# Altium schematic sheet 12-JKFlipFlop.SchDoc
size A4; DocumentNumber: 12; SheetNumber: 12; SheetTotal: 26
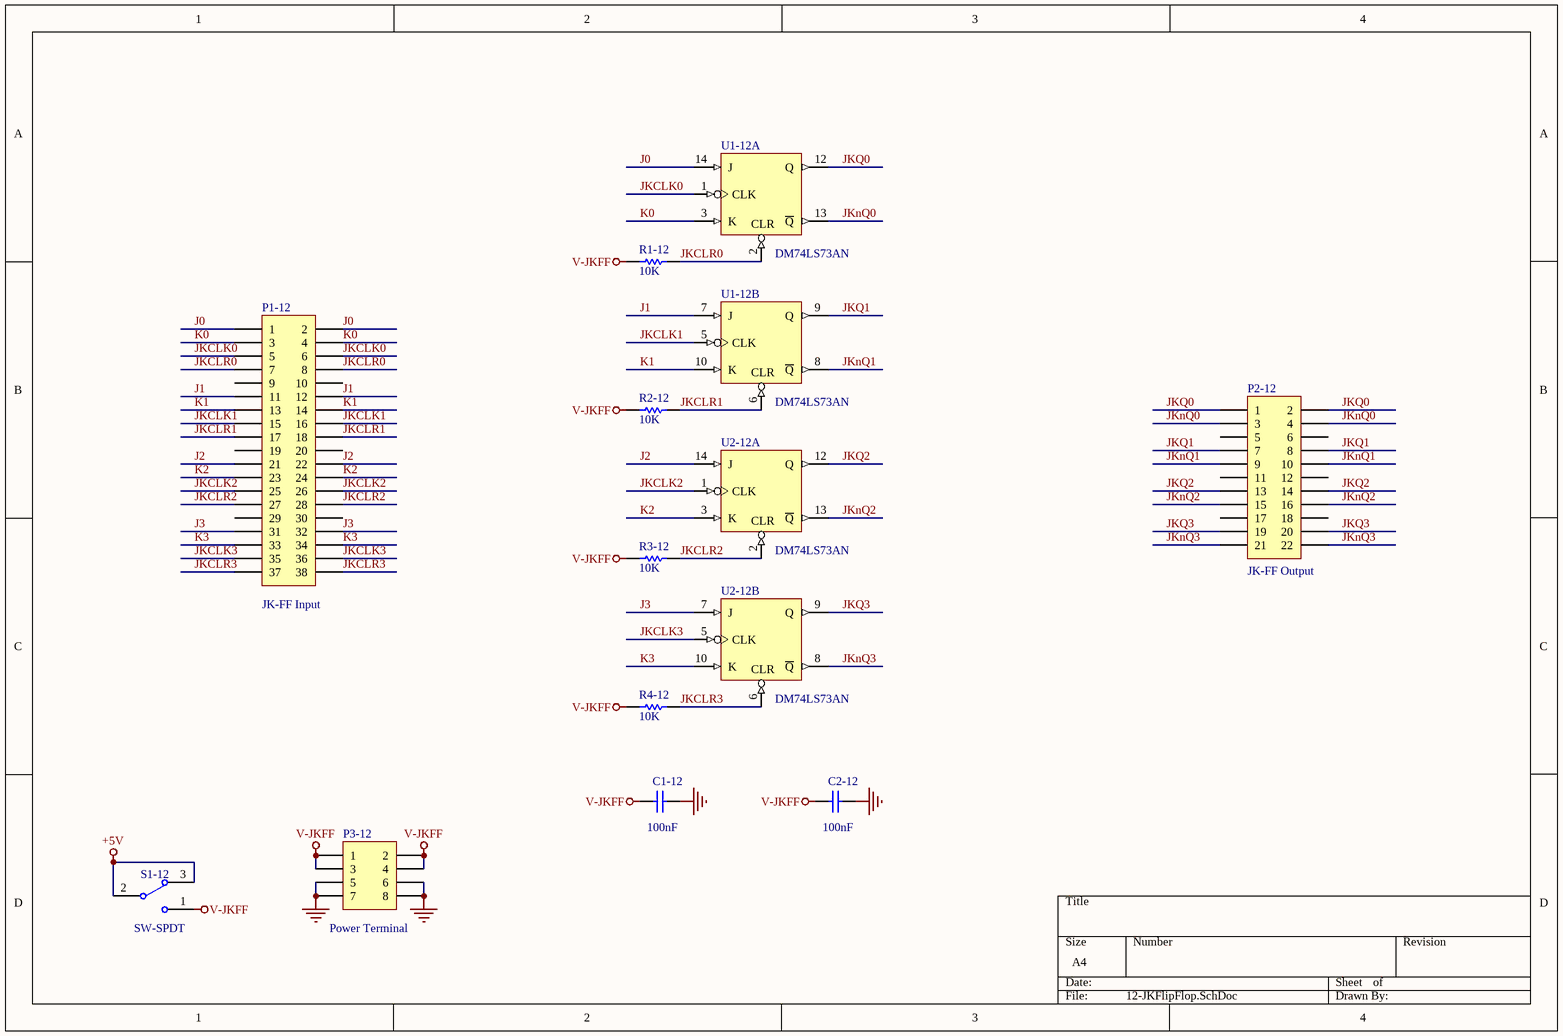
[diagram p0: 12-JKFlipFlop.SchDoc]

## Parts
C1-12  value 100nF  [c-0805]  (hidden comment: 104)
C2-12  value 100nF  [c-0805]  (hidden comment: 104)
P1-12  value JK-FF Input  [JP2.54-F-2x19A]  (hidden comment: Header 19X2)
P2-12  value JK-FF Output  [JP2.54-F-2x11A]  (hidden comment: Header 11X2)
P3-12  Publisher: Power Terminal  [JP2.54-F-2x04A]  (hidden comment: Header 4X2)
R1-12  10K  [R-0805]
R2-12  10K  [R-0805]
R3-12  10K  [R-0805]
R4-12  10K  [R-0805]
S1-12  SW-SPDT  [SW-SLIDE-2P-2W]
U1-12  DM74LS73AN  [SK-DIP14-300]  (parts A,B of 2)
U2-12  DM74LS73AN  [SK-DIP14-300]  (parts A,B of 2)

## Nets
+5V: S1-12.2 S1-12.3
GND: C1-12.2 C2-12.2 P3-12.5 P3-12.6 P3-12.7 P3-12.8 U1-12.11(GND) U2-12.11(GND)
V-JKFF: C1-12.1 C2-12.1 P3-12.1 P3-12.2 P3-12.3 P3-12.4 R1-12.2 R2-12.2 R3-12.2 R4-12.2 S1-12.1
VCC: U1-12.4(V-JKFF) U2-12.4(V-JKFF)
J0: P1-12.1 P1-12.2 U1-12.14(J)
J1: P1-12.11 P1-12.12 U1-12.7(J)
J2: P1-12.21 P1-12.22 U2-12.14(J)
J3: P1-12.31 P1-12.32 U2-12.7(J)
JKCLK0: P1-12.5 P1-12.6 U1-12.1(CLK)
JKCLK1: P1-12.15 P1-12.16 U1-12.5(CLK)
JKCLK2: P1-12.25 P1-12.26 U2-12.1(CLK)
JKCLK3: P1-12.35 P1-12.36 U2-12.5(CLK)
JKCLR0: P1-12.7 P1-12.8 R1-12.1 U1-12.2(CLR)
JKCLR1: P1-12.17 P1-12.18 R2-12.1 U1-12.6(CLR)
JKCLR2: P1-12.27 P1-12.28 R3-12.1 U2-12.2(CLR)
JKCLR3: P1-12.37 P1-12.38 R4-12.1 U2-12.6(CLR)
JKnQ0: P2-12.3 P2-12.4 U1-12.13(~{Q})
JKnQ1: P2-12.9 P2-12.10 U1-12.8(~{Q})
JKnQ2: P2-12.15 P2-12.16 U2-12.13(~{Q})
JKnQ3: P2-12.21 P2-12.22 U2-12.8(~{Q})
JKQ0: P2-12.1 P2-12.2 U1-12.12(Q)
JKQ1: P2-12.7 P2-12.8 U1-12.9(Q)
JKQ2: P2-12.13 P2-12.14 U2-12.12(Q)
JKQ3: P2-12.19 P2-12.20 U2-12.9(Q)
K0: P1-12.3 P1-12.4 U1-12.3(K)
K1: P1-12.13 P1-12.14 U1-12.10(K)
K2: P1-12.23 P1-12.24 U2-12.3(K)
K3: P1-12.33 P1-12.34 U2-12.10(K)

Not connected (* = marked no-connect by the designer): P1-12 9 10 19 20 29 30; P2-12 5 6 11 12 17 18

## Library data of the parts
C1-12 C2-12 = Cap: Capacitor; Published: 8-Jun-2000; LatestRevisionDate: 17-Jul-2002; LatestRevisionNote: Re-released for DXP Platform.; PackageReference: RAD-0.3; Publisher: Altium Limited; PackageDescription: Radial Cap, Thru-Hole; 2 Leads; 0.3 in Pin Spacing
P1-12 = Header 19X2: Header, 19-Pin, Dual row; LatestRevisionDate: 17-Jul-2002; LatestRevisionNote: Re-released for DXP Platform.
P2-12 = Header 11X2: Header, 11-Pin, Dual row; LatestRevisionDate: 17-Jul-2002; LatestRevisionNote: Re-released for DXP Platform.
P3-12 = Header 4X2: Header, 4-Pin, Dual row; LatestRevisionDate: 17-Jul-2002; LatestRevisionNote: Re-released for DXP Platform.
R1-12 R2-12 R3-12 R4-12 = Res1: Resistor; Published: 8-Jun-2000; LatestRevisionDate: 17-Jul-2002; LatestRevisionNote: Re-released for DXP Platform.; PackageReference: AXIAL-0.3; Publisher: Altium Limited; PackageDescription: Axial Device, Thru-Hole; 2 Leads; 0.3 in Pin Spacing; Value: 10K
S1-12 = SW-SPDT: SPDT Subminiature Toggle Switch, Right Angle Mounting, Vertical Actuation; Published: 24-Mar-1999; LatestRevisionDate: 17-Dec-2003; LatestRevisionNote: Schematic revised, PCB Footprint replaced.; DatasheetVersion: 05-Dec-2000; PackageReference: TL36WW15050; Publisher: Altium Limited; PackageDescription: Switch; 4 Leads; ComponentLink1Description: Manufacturer Link; ComponentLink1URL: http://www.apem.com
U1-12 U2-12 = DM74LS73AN: Dual Negative-Edge-Triggered Master-Slave J-K Flip-Flop with Clear and Complementary Output; Published: 17-Jul-2002; LatestRevisionDate: 29-May-2009; LatestRevisionNote: Component Body Added.; DatasheetVersion: Mar-1998; PackageVersion: 2000; PackageReference: N14A; Publisher: Altium Limited; PackageDescription: DIP, 14-Pin, Row Spacing 7.62 mm, Pitch 2.54 mm; ComponentLink1Description: Manufacturer Link; ComponentLink1URL: http://www.fairchildsemi.com/